# Altium project PCB_Project1.PrjPCB
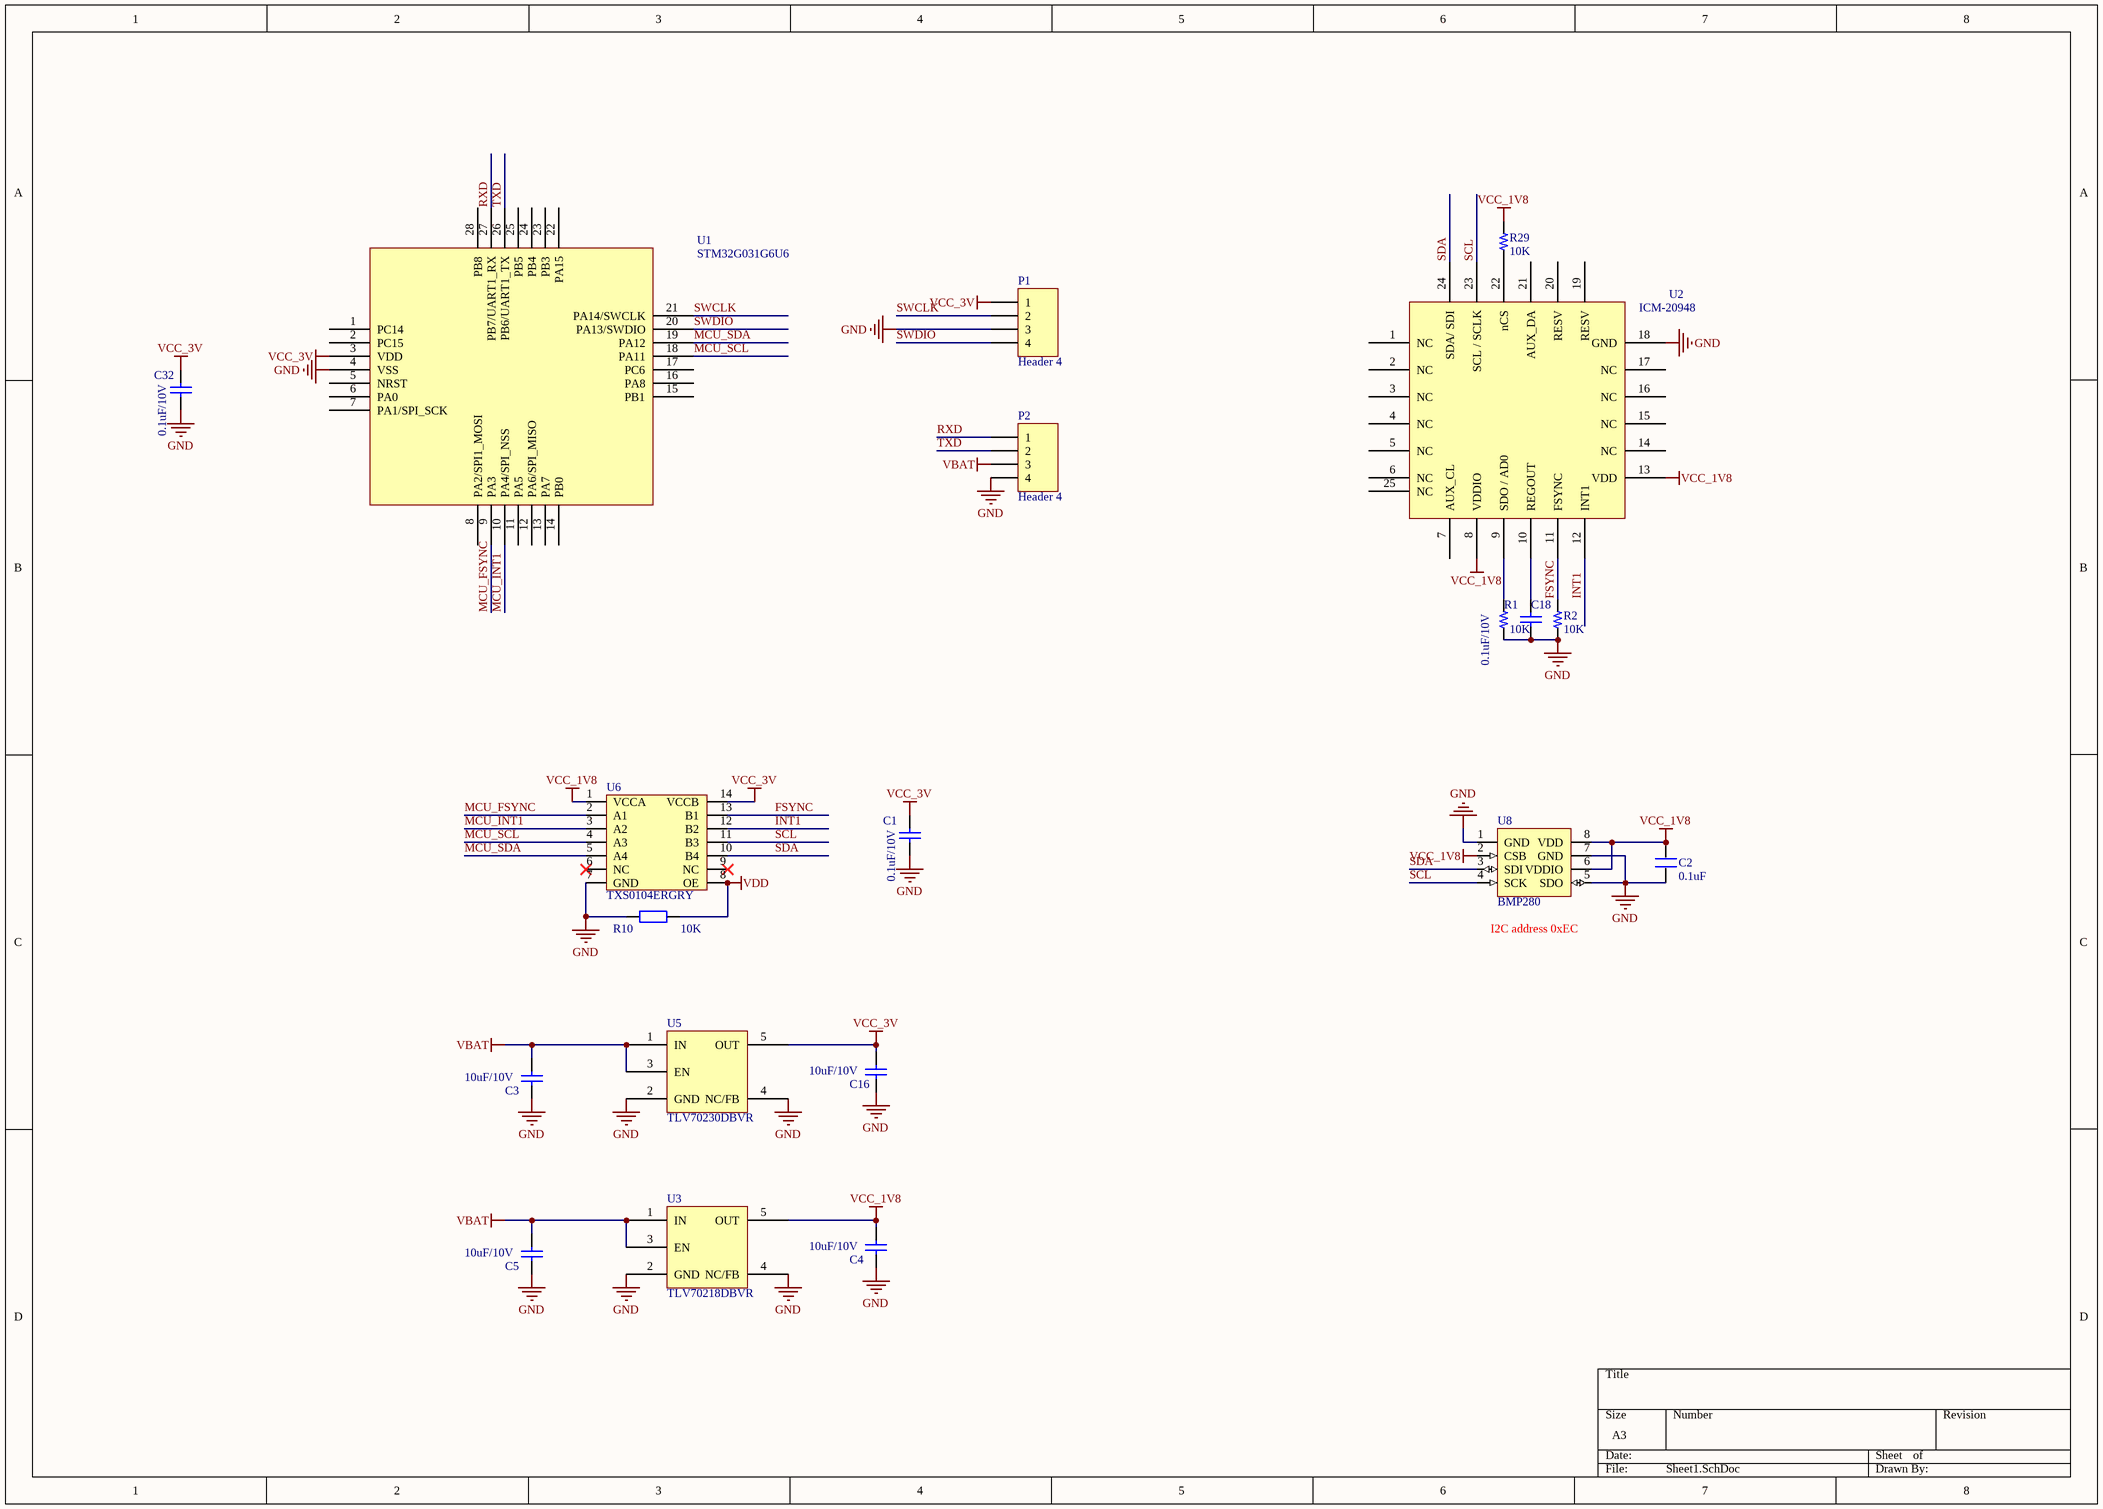
[diagram p0: Sheet1.SchDoc]
1 sheet, 20 parts. Net scope: global (net labels, ports and power ports of the same name join across sheets).
Board file: PCB1.PcbDoc

## Sheet Sheet1.SchDoc
size A3

### Parts
C1  0.1uF/10V  [0402C]
C2  0.1uF  [0402C]
C3  10uF/10V  [0603C]
C4  10uF/10V  [0603C]
C5  10uF/10V  [0603C]
C16  10uF/10V  [0603C]
C18  0.1uF/10V  [0402C]
C32  0.1uF/10V  [0402C]
P1  Header 4  [HDR1X4]
P2  Header 4  [HDR1X4]
R1  10K  [0402R]
R2  10K  [0402R]
R10  10K  [0402R]
R29  10K  [0402R]
U1  STM32G031G6U6  [STM32G031G6U6]
U2  ICM-20948  [QFN24-0.4]
U3  TLV70218DBVR  [SOT23-5(DBV)]
U5  TLV70230DBVR  [SOT23-5(DBV)]
U6  TXS0104ERGRY  [TXS0104ERGRY]
U8  BMP280  [LGA-8]

### Nets
GND: C1.2 C2.1 C3.1 C4.1 C5.1 C16.1 C18.2 C32.2 P1.3 P2.4 R1.1 R2.1 R10.1 U1.4(VSS) U2.18(GND) U3.2(GND) U3.4(NC/FB) U5.2(GND) U5.4(NC/FB) U6.7(GND) U8.1(GND) U8.5(SDO) U8.7(GND)
VBAT: C3.2 C5.2 P2.3 U3.1(IN) U3.3(EN) U5.1(IN) U5.3(EN)
VCC_1V8: C2.2 C4.2 R29.2 U2.8(VDDIO) U2.13(VDD) U3.5(OUT) U6.1(VCCA) U8.2(CSB) U8.6(VDDIO) U8.8(VDD)
VCC_3V: C1.1 C16.2 C32.1 P1.1 U1.3(VDD) U5.5(OUT) U6.14(VCCB)
VDD: R10.2 U6.8(OE)
FSYNC: R2.2 U2.11(FSYNC) U6.13(B1)
INT1: U2.12(INT1) U6.12(B2)
MCU_FSYNC: U1.9(PA3) U6.2(A1)
MCU_INT1: U1.10(PA4/SPI_NSS) U6.3(A2)
MCU_SCL: U1.18(PA11) U6.4(A3)
MCU_SDA: U1.19(PA12) U6.5(A4)
RXD: P2.1 U1.27(PB7/UART1_RX)
SCL: U2.23(SCL_/_SCLK) U6.11(B3) U8.4(SCK)
SDA: U2.24(SDA/_SDI) U6.10(B4) U8.3(SDI)
SWCLK: P1.2 U1.21(PA14/SWCLK)
SWDIO: P1.4 U1.20(PA13/SWDIO)
TXD: P2.2 U1.26(PB6/UART1_TX)
NetC18_1: C18.1 U2.10(REGOUT)
NetR1_2: R1.2 U2.9(SDO_/_AD0)
NetR29_1: R29.1 U2.22(nCS)

Not connected (* = marked no-connect by the designer): U1 1(PC14) 2(PC15) 5(NRST) 6(PA0) 7(PA1/SPI_SCK) 8(PA2/SPI1_MOSI) 11(PA5) 12(PA6/SPI_MISO) 13(PA7) 14(PB0) 15(PB1) 16(PA8) 17(PC6) 22(PA15) 23(PB3) 24(PB4) 25(PB5) 28(PB8); U2 1(NC) 2(NC) 3(NC) 4(NC) 5(NC) 6(NC) 7(AUX_CL) 14(NC) 15(NC) 16(NC) 17(NC) 19(RESV) 20(RESV) 21(AUX_DA) 25(NC); U6 6(NC)* 9(NC)*

### Notes on the sheet
- (near U8) I2C address 0xEC

### Library data of the parts
C1 C18 C32 = Cap: Capacitor; Value: 104; Published: 8-Jun-2000; LatestRevisionDate: 17-Jul-2002; LatestRevisionNote: Re-released for DXP Platform.; PackageReference: RAD-0.3; Publisher: Altium Limited
C2 = C
C3-C5 C16 = Cap: Capacitor; Value: 106/50V; Published: 8-Jun-2000; LatestRevisionDate: 17-Jul-2002; LatestRevisionNote: Re-released for DXP Platform.; PackageReference: RAD-0.3; Publisher: Altium Limited
P1 P2 = Header 4: Header, 4-Pin; LatestRevisionDate: 17-Jul-2002; LatestRevisionNote: Re-released for DXP Platform.; Publisher: Altium Limited
R1 R2 R29 = R
R10 = Res2: Resistor; Published: 8-Jun-2000; LatestRevisionDate: 17-Jul-2002; LatestRevisionNote: Re-released for DXP Platform.; PackageReference: AXIAL-0.4; Publisher: Altium Limited; Value: 10K
U3 = TLV70230DBVR
U6 = TXS0104EPWR